# EAGLE design KNXTransceiverBoard_V1.0 (EAGLE 6.1)

## Sheet 1 of 3
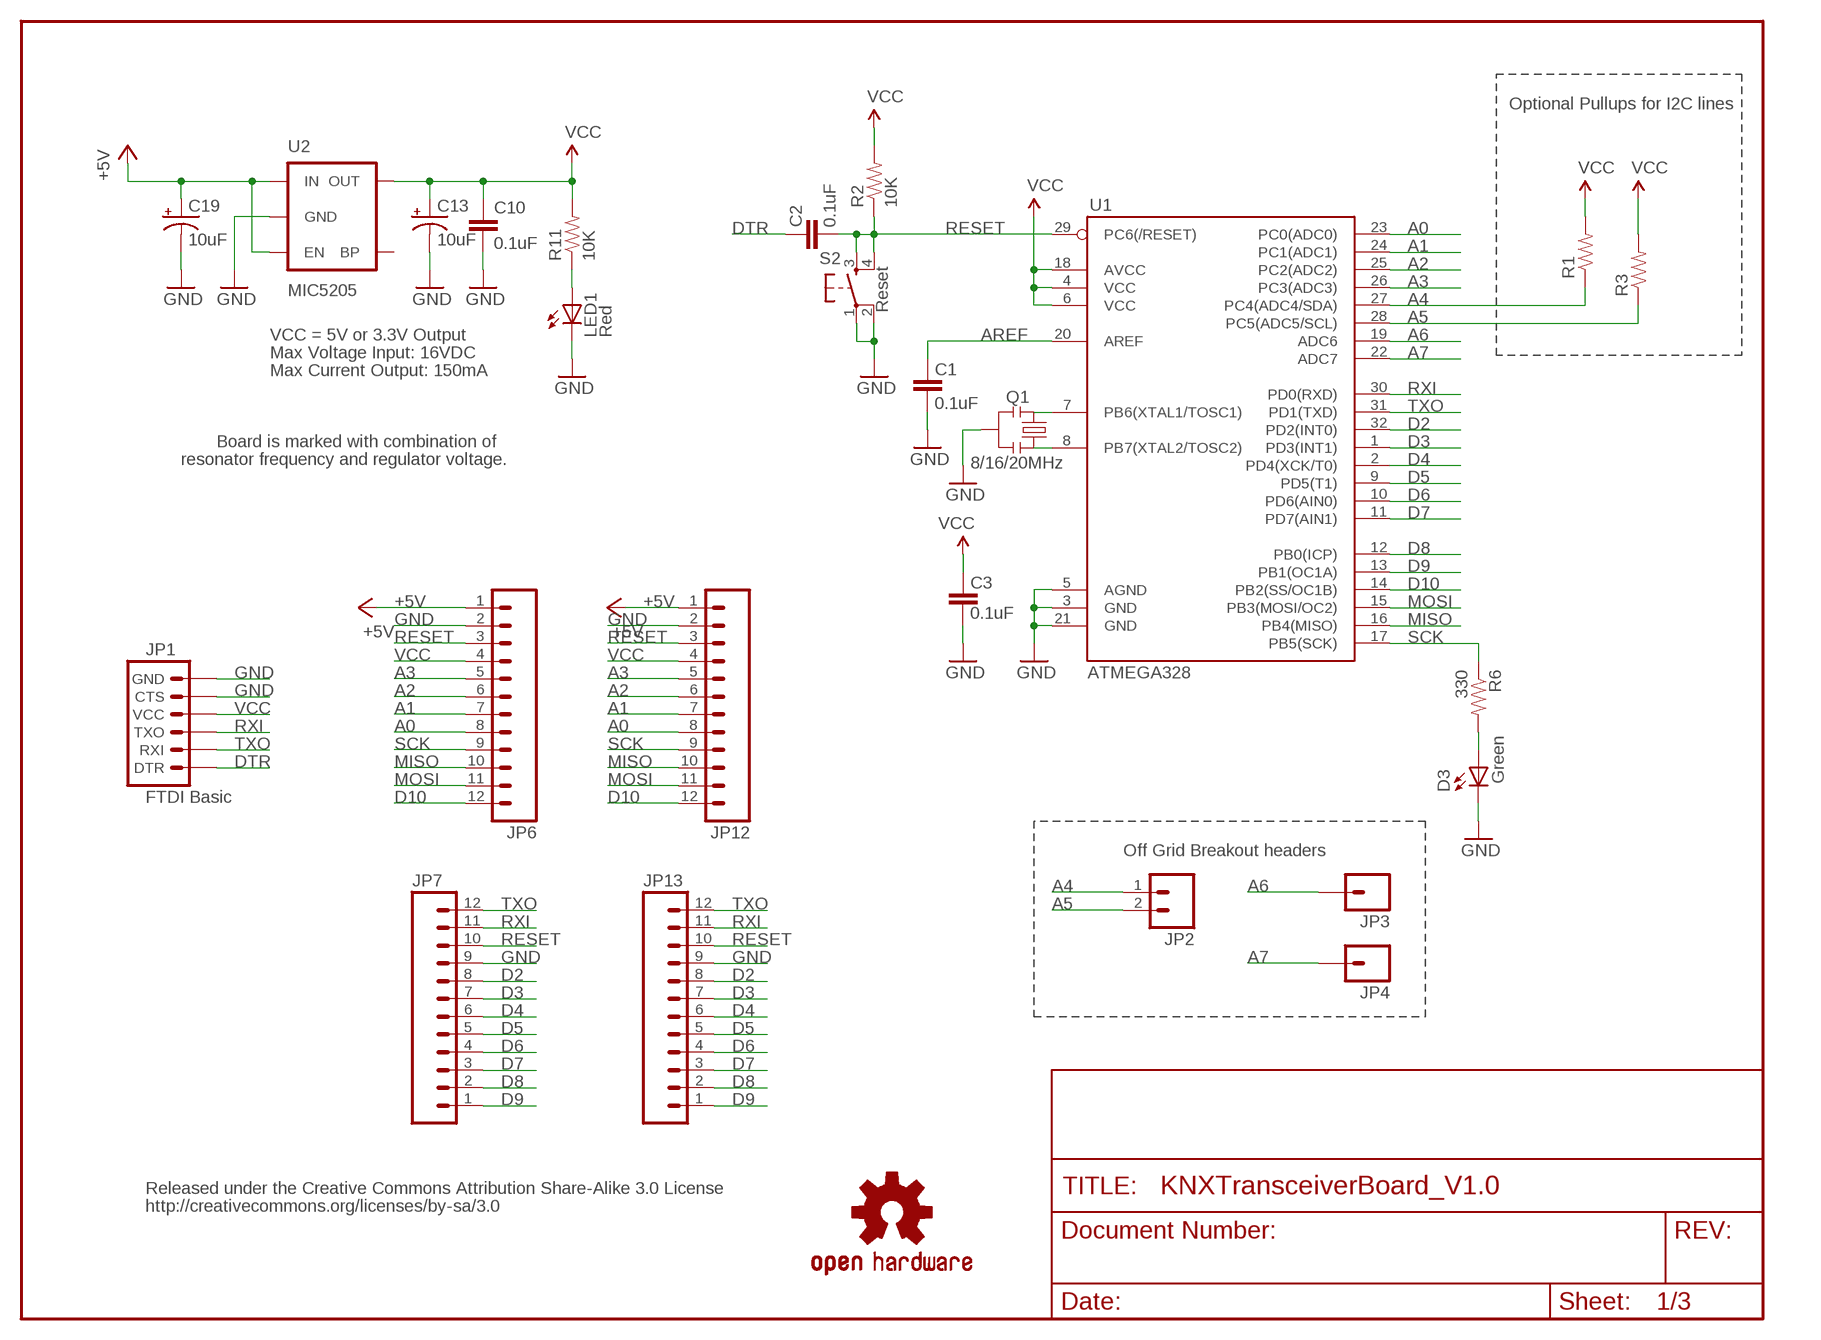
[diagram p0: schematic, sheet 1]

### Parts
C1  0.1uF  CAP0603-CAP  [0603-CAP]
C2  0.1uF  CAP0603-CAP  [0603-CAP]
C3  0.1uF  CAP0603-CAP  [0603-CAP]
C10  0.1uF  CAP0603-CAP  [0603-CAP]
C13  10uF  CAP_POL1206  [EIA3216]
C19  10uF  CAP_POL1206  [EIA3216]
D3  Green  LED0603  [LED-0603]
JP1  FTDI Basic  ARDUINO_SERIAL_PROGRAMPTH  [1X06]
JP2  M02PTH  [1X02]
JP3  M01PTH  [1X01]
JP4  M01PTH  [1X01]
JP6  M12PTH  [1X12]
JP7  M12PTH  [1X12]
JP12  M12PTH  [1X12]
JP13  M12PTH  [1X12]
LED1  Red  LED0603  [LED-0603]
Q1  8/16/20MHz  RESONATORSMD  [RESONATOR-SMD]
R1  RESISTOR0603-RES  [0603-RES]
R2  10K  RESISTOR0603-RES  [0603-RES]
R3  RESISTOR0603-RES  [0603-RES]
R6  330  RESISTOR0603-RES  [0603-RES]
R11  10K  RESISTOR0603-RES  [0603-RES]
S2  Reset  TAC_SWITCHSMD  [TACTILE_SWITCH_SMD]
U1  ATMEGA328  ATMEGA168  [TQFP32-08]
U2  MIC5205  V_REG_LDOSMD  [SOT23-5]
U$3  OSHW-LOGOS  [OSHW-LOGO-S]

### Nets
+5V [vcc]: C19.A(+) JP6.1 JP12.1 U2.1(IN) U2.3(EN) ; also sheet 2
A0: JP6.8 JP12.8 U1.23(PC0(ADC0))
A1: JP6.7 JP12.7 U1.24(PC1(ADC1))
A2: JP6.6 JP12.6 U1.25(PC2(ADC2))
A3: JP6.5 JP12.5 U1.26(PC3(ADC3))
A4: JP2.1 R1.1 U1.27(PC4(ADC4/SDA))
A5: JP2.2 R3.1 U1.28(PC5(ADC5/SCL))
A6: JP3.1 U1.19(ADC6)
A7: JP4.1 U1.22(ADC7)
AREF: C1.2 U1.20(AREF)
D2: JP7.8 JP13.8 U1.32(PD2(INT0)) ; also sheet 3
D3: JP7.7 JP13.7 U1.1(PD3(INT1)) ; also sheet 3
D4: JP7.6 JP13.6 U1.2(PD4(XCK/T0))
D5: JP7.5 JP13.5 U1.9(PD5(T1))
D6: JP7.4 JP13.4 U1.10(PD6(AIN0))
D7: JP7.3 JP13.3 U1.11(PD7(AIN1))
D8: JP7.2 JP13.2 U1.12(PB0(ICP)) ; also sheet 3
D9: JP7.1 JP13.1 U1.13(PB1(OC1A))
D10: JP6.12 JP12.12 U1.14(PB2(SS/OC1B))
DTR: C2.2 JP1.1(DTR)
GND: C1.1 C3.1 C10.2 C13.C(-) C19.C(-) D3.C JP1.5(CTS) JP1.6(GND) JP6.2 JP7.9 JP12.2 JP13.9 LED1.C Q1.2 S2.1 S2.2 U1.3(GND) U1.5(AGND) U1.21(GND) U2.2(GND) ; also sheet 2,3
MISO: JP6.10 JP12.10 U1.16(PB4(MISO))
MOSI: JP6.11 JP12.11 U1.15(PB3(MOSI/OC2))
N$1: Q1.1 U1.8(PB7(XTAL2/TOSC2))
N$2: Q1.3 U1.7(PB6(XTAL1/TOSC1))
N$7: D3.A R6.2
N$38: LED1.A R11.1
RESET: C2.1 JP6.3 JP7.10 JP12.3 JP13.10 R2.1 S2.3 S2.4 U1.29(PC6(/RESET))
RXI: JP1.3(TXO) JP7.11 JP13.11 U1.30(PD0(RXD)) ; also sheet 3
SCK: JP6.9 JP12.9 R6.1 U1.17(PB5(SCK))
TXO: JP1.2(RXI) JP7.12 JP13.12 U1.31(PD1(TXD)) ; also sheet 3
VCC: C3.2 C10.1 C13.A(+) JP1.4(VCC) JP6.4 JP12.4 R1.2 R2.2 R3.2 R11.2 U1.4(VCC) U1.6(VCC) U1.18(AVCC) U2.5(OUT) ; also sheet 2,3
Unconnected: U2.4(BP)

### Notes on the sheet
- Optional Pullups for I2C lines
- VCC = 5V or 3.3V Output
- Max Voltage Input: 16VDC
- Max Current Output: 150mA
- Board is marked with combination of
- resonator frequency and regulator voltage.
- Off Grid Breakout headers
- Released under the Creative Commons Attribution Share-Alike 3.0 License
- http://creativecommons.org/licenses/by-sa/3.0

## Sheet 2 of 3
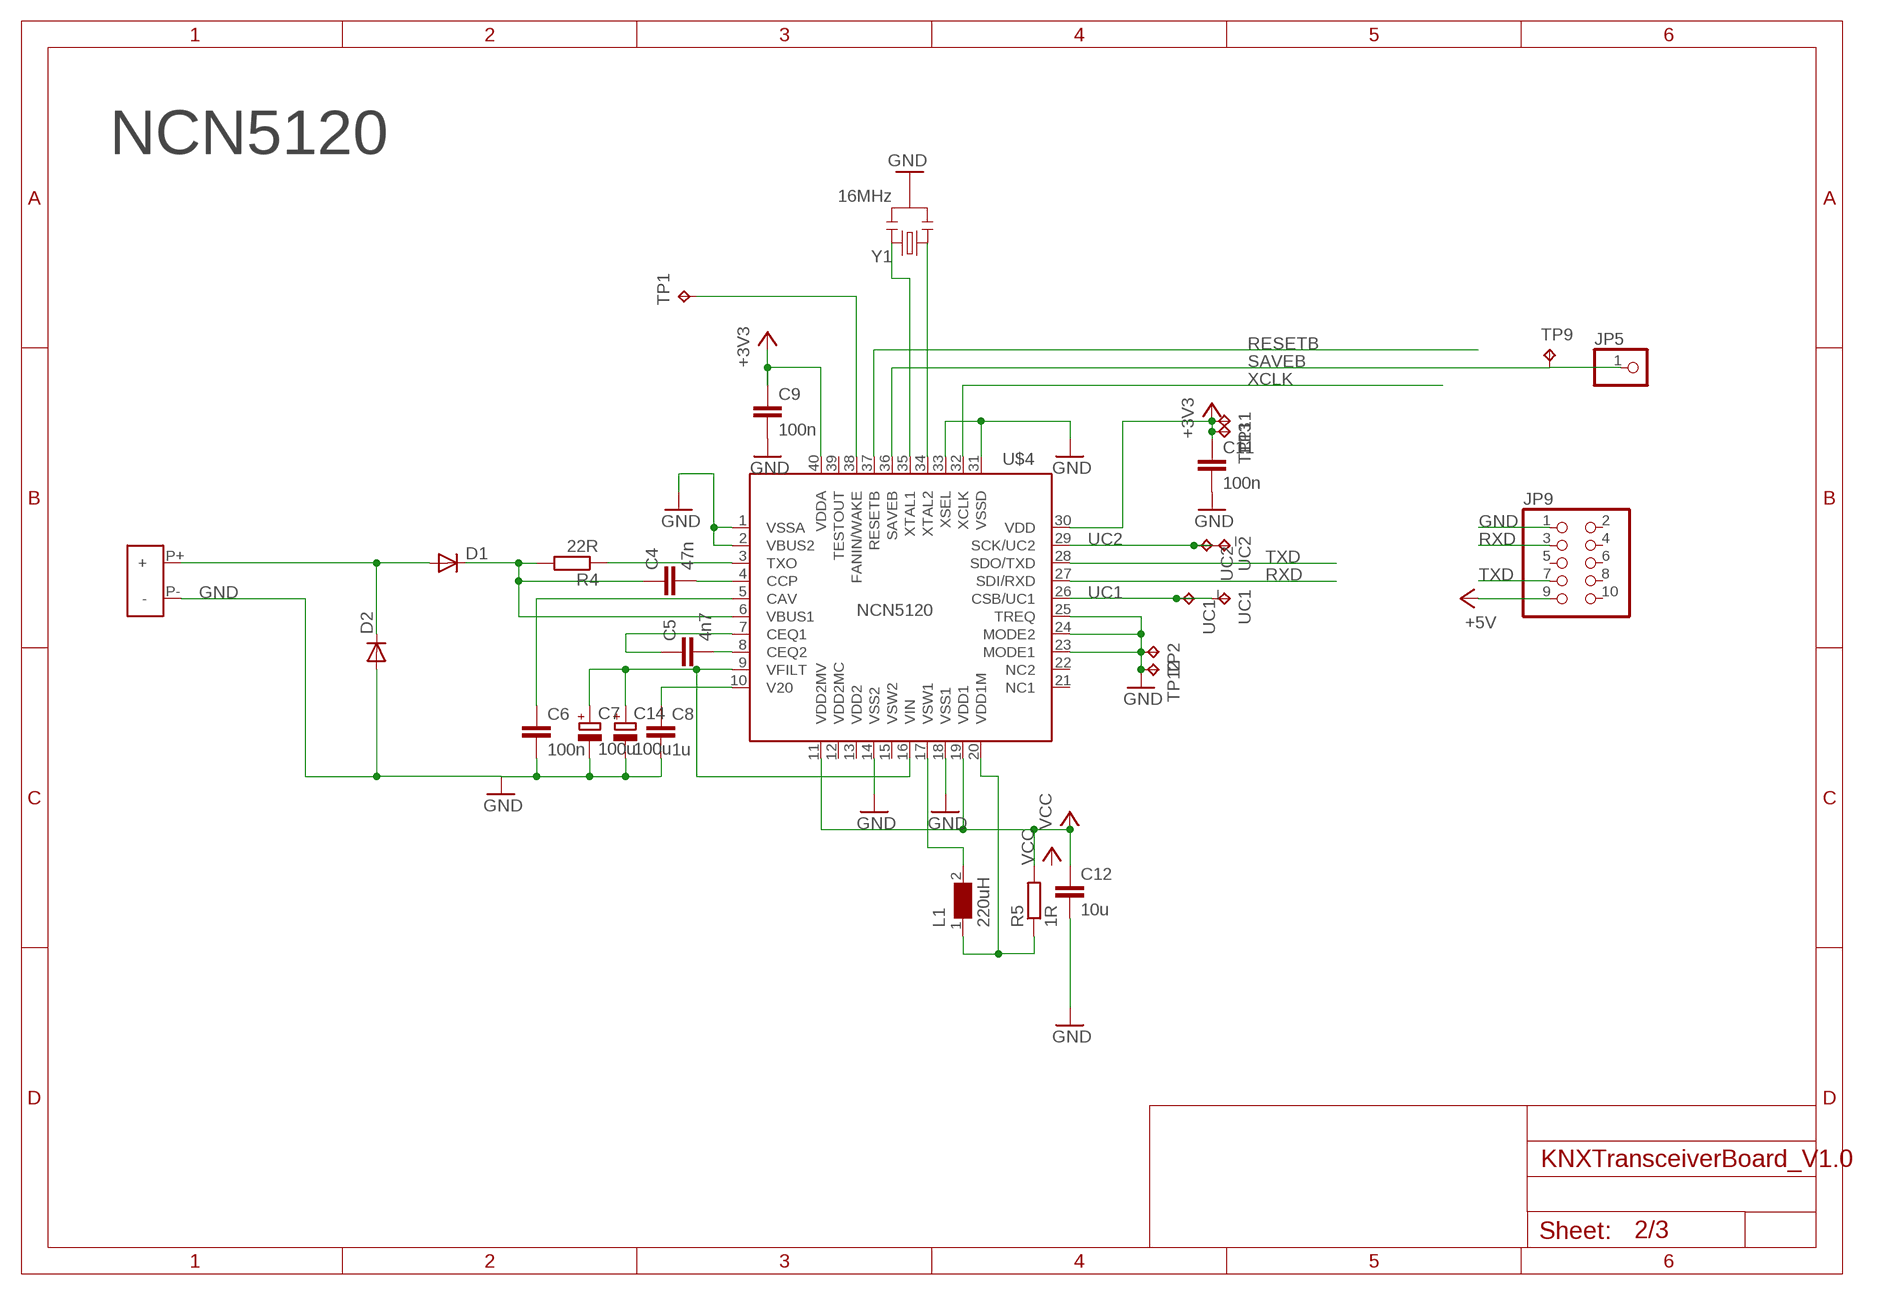
[diagram p1: schematic, sheet 2]

### Parts
C4  47n  C-EUC0603  [C0603]
C5  4n7  C-EUC0603  [C0603]
C6  100n  C-EUC0603  [C0603]
C7  100u  CPOL-EUSMCD  [SMC_D]
C8  1u  C-EUC0603  [C0603]
C9  100n  C-EUC0603  [C0603]
C11  100n  C-EUC0603  [C0603]
C12  10u  C-EUC0805  [C0805]
C14  100u  CPOL-EUSMCD  [SMC_D]
D1  DIODESMA-ALT  [SMA-DIODE_ALT]
D2  DIODESMA-ALT  [SMA-DIODE_ALT]
JP5  PINHD-1X1  [1X01]
JP9  PINHD-2X5  [2X05]
L1  220uH  WE-PD2_7850  [WE-PD2_7850]
R4  22R  R-EU_R2512  [R2512]
R5  1R  R-EU_R0603  [R0603]
TP1  TPTP10SQ  [TP10SQ]
TP2  TPTP09SQ  [TP09SQ]
TP9  TPTP10SQ  [TP10SQ]
TP11  TPTP09SQ  [TP09SQ]
TP12  TPTP09SQ  [TP09SQ]
TP13  TPTP09SQ  [TP09SQ]
U$2  KNX_KLEMME  [KNX_KLEMME]
U$4  NCN5120_KNX_TRANSCEIVER  [QFN40]
UC1  TPTP09SQ  [TP09SQ]
UC1_  TPTP09SQ  [TP09SQ]
UC2  TPTP09SQ  [TP09SQ]
UC2_  TPTP09SQ  [TP09SQ]
Y1  16MHz  RESONATORSMD  [RESONATOR-SMD]

### Nets
+5V [vcc]: JP9.9 ; also sheet 1
GND: C6.2 C7.- C8.2 C9.2 C11.2 C12.2 C14.- D2.A JP9.1 TP2.TP TP12.TP U$2.P-(-) U$4.1(VSSA) U$4.2(VBUS2) U$4.14(VSS2) U$4.18(VSS1) U$4.23(MODE1) U$4.24(MODE2) U$4.25(TREQ) U$4.31(VSSD) U$4.33(XSEL) Y1.2 ; also sheet 1,3
N$3: R4.1 U$4.3(TXO)
N$4: C4.1 D1.C R4.2 U$4.6(VBUS1)
N$5: C5.1 U$4.7(CEQ1)
N$6: C7.+ C14.+ U$4.9(VFILT) U$4.16(VIN)
N$8: C8.1 U$4.10(V20)
N$9: C6.1 U$4.5(CAV)
N$10: C4.2 U$4.4(CCP)
N$11: C5.2 U$4.8(CEQ2)
N$12: D1.A D2.C U$2.P+(+)
N$14: TP1.TP U$4.38(FANIN/WAKE)
N$17: U$4.35(XTAL1) Y1.3
N$18: U$4.34(XTAL2) Y1.1
N$22: L1.2 U$4.17(VSW1)
N$24: L1.1 R5.1 U$4.20(VDD1M)
RESETB: U$4.37(RESETB)
RXD: JP9.3 U$4.27(SDI/RXD) ; also sheet 3
SAVEB: JP5.1 TP9.TP U$4.36(SAVEB)
TXD: JP9.7 U$4.28(SDO/TXD) ; also sheet 3
UC1: U$4.26(CSB/UC1) UC1.TP UC1_.TP
UC2: U$4.29(SCK/UC2) UC2.TP UC2_.TP
VCC: C9.1 C11.1 C12.1 R5.2 TP11.TP TP13.TP U$4.11(VDD2MV) U$4.19(VDD1) U$4.30(VDD) U$4.40(VDDA) ; supply symbol labelled +3V3 ; also sheet 1,3
XCLK: U$4.32(XCLK)
Unconnected: JP9.2 JP9.4 JP9.5 JP9.6 JP9.8 JP9.10 U$4.12(VDD2MC) U$4.13(VDD2) U$4.15(VSW2) U$4.21(NC1) U$4.22(NC2) U$4.39(TESTOUT)

### Notes on the sheet
- NCN5120

## Sheet 3 of 3
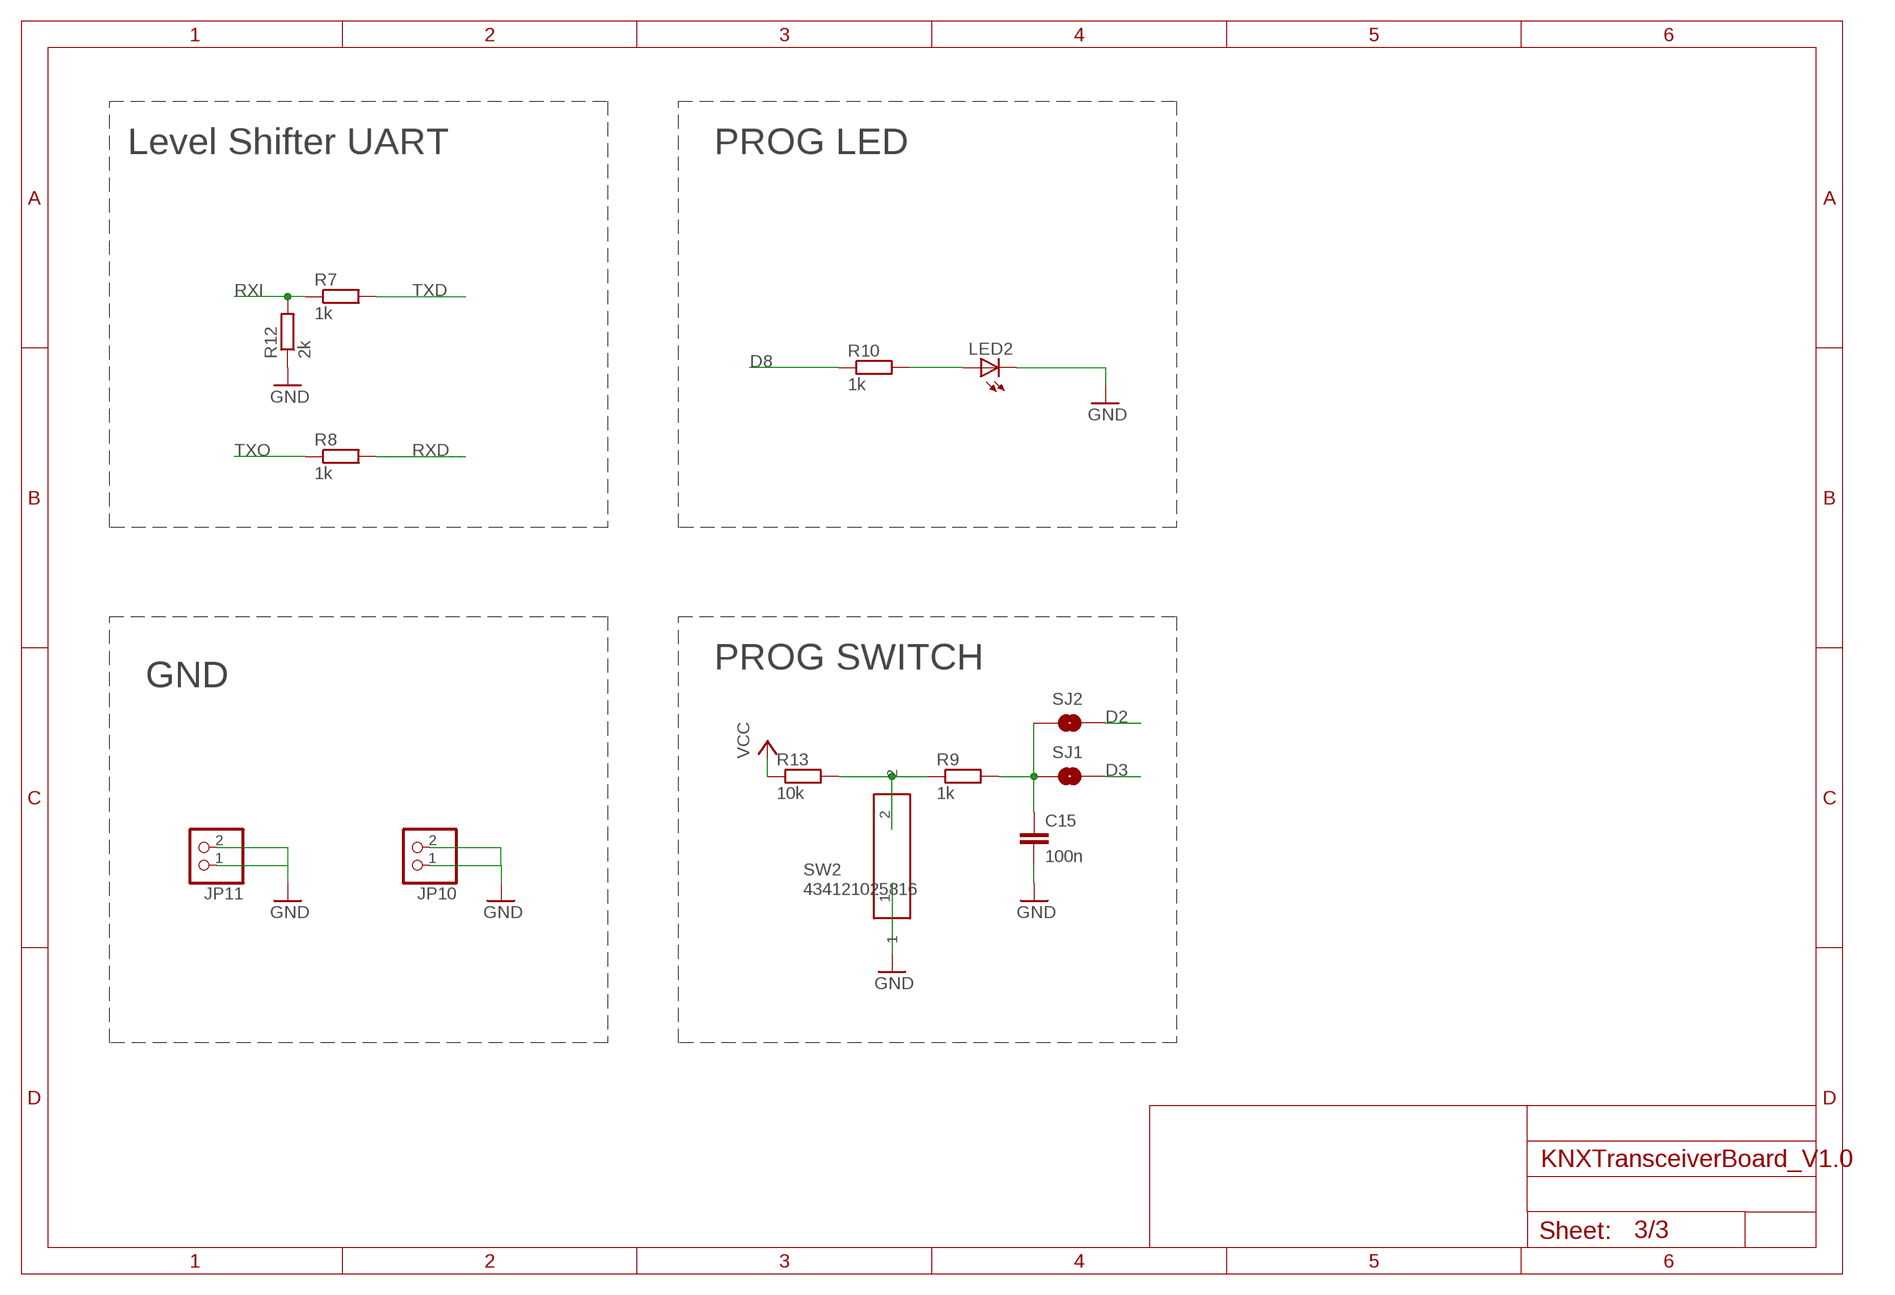
[diagram p2: schematic, sheet 3]

### Parts
C15  100n  C-EUC0603  [C0603]
JP10  PINHD-1X2  [1X02]
JP11  PINHD-1X2  [1X02]
LED2  LEDCHIP-LED0805  [CHIP-LED0805]
R7  1k  R-EU_R0603  [R0603]
R8  1k  R-EU_R0603  [R0603]
R9  1k  R-EU_R0603  [R0603]
R10  1k  R-EU_R0603  [R0603]
R12  2k  R-EU_R0805  [R0805]
R13  10k  R-EU_R0603  [R0603]
SJ1  Closed for 5V Board  SOLDERJUMPERNC  [SJ_2S]
SJ2  Closed for 5V Board  SOLDERJUMPERNC  [SJ_2S]
SW2  434121025816  [434121025816]

### Nets
D2: SJ2.2 ; also sheet 1
D3: SJ1.2 ; also sheet 1
D8: R10.1 ; also sheet 1
GND: C15.2 JP10.1 JP10.2 JP11.1 JP11.2 LED2.C R12.1 SW2.1 ; also sheet 1,2
N$13: R9.1 R13.2 SW2.2
N$15: LED2.A R10.2
PROG_SW: C15.1 R9.2 SJ1.1 SJ2.1
RXD: R8.2 ; also sheet 2
RXI: R7.1 R12.2 ; also sheet 1
TXD: R7.2 ; also sheet 2
TXO: R8.1 ; also sheet 1
VCC: R13.1 ; also sheet 1,2

### Notes on the sheet
- Level Shifter UART | PROG LED
- PROG SWITCH
- GND

## Library data of the parts
C1-C3 C10 = SparkFun:CAP: Capacitor Standard 0603 ceramic capacitor, and 0.1" leaded capacitor.
C4-C6 C8 C9 C11 C12 C15 = rcl:C-EU: CAPACITOR, European symbol
C7 C14 = rcl:CPOL-EU: POLARIZED CAPACITOR, European symbol
C13 C19 = SparkFun:CAP_POL: Capacitor Polarized These are standard SMD and PTH capacitors. Normally 10uF, 47uF, and 100uF in electrolytic and tantalum varieties. Always verify the external diameter of the through hole cap, it varies with capacity, voltage, and manufacturer. The EIA devices should be standard.
D1 D2 = SparkFun:DIODE: Diode These are standard reverse protection diodes and small signal diodes. SMA package can handle up to about 1A. SOD-323 can handle about 200mA. What the SOD-323 package when ordering, there are some mfgs out there that are 5-pin packages.
D3 LED1 = SparkFun:LED: LEDs Standard schematic elements and footprints for 5mm, 3mm, 1206, and 0603 sized LEDs. 5mm - Spark Fun Electronics SKU : COM-00529 (and others)
JP1 = SparkFun:ARDUINO_SERIAL_PROGRAM
JP2 = SparkFun:M02: Header 2 Standard 2-pin 0.1" header. Use with straight break away headers (SKU : PRT-00116), right angle break away headers (PRT-00553), swiss pins (PRT-00743), machine pins (PRT-00117), and female headers (PRT-00115). Molex polarized connector foot print use with SKU : PRT-08233 with associated crimp pins and housings.
JP3 JP4 = SparkFun:M01: Header 1 Standard 1-pin 0.1" header. Use with straight break away headers (SKU : PRT-00116), right angle break away headers (PRT-00553), swiss pins (PRT-00743), machine pins (PRT-00117), and female headers (PRT-00115).
JP5 = pinhead:PINHD-1X1: PIN HEADER
JP6 JP7 JP12 JP13 = SparkFun:M12: Header 12 Standard 12-pin 0.1" header. Use with straight break away headers (SKU : PRT-00116), right angle break away headers (PRT-00553), swiss pins (PRT-00743), machine pins (PRT-00117), and female headers (PRT-00115).
JP9 = pinhead:PINHD-2X5: PIN HEADER
JP10 JP11 = pinhead:PINHD-1X2: PIN HEADER
L1 = Wuerth_PowerMagnetics:WE-PD2: SMD-Power Inductors WE-PD2 - Industry standard size - Current capability up to 14 A -- Switching regulators with low operating voltages (computer, laptop, mobile phones, pagers) -- Integrated DC/DC-converter -- Is recommended for the application with switching regulators from National Semiconductor, Linear Technology, Texas Instruments and Fairchild Semiconductor -- Perfectly suitable for switching regulators with extremely high efficiency
LED2 = adafruit:LED: LED OSRAM: - CHIPLED LG R971, LG N971, LY N971, LG Q971, LY Q971, LO R971, LY R971 LH N974, LH R974 LS Q976, LO Q976, LY Q976 LO Q996 - Hyper CHIPLED LW Q18S LB Q993, LB Q99A, LB R99A - SideLED LS A670, LO A670, LY A670, LG A670, LP A670 LB A673, LV A673, LT A673, LW A673 LH A674 LY A675 LS A676, LA A676, LO A676, LY A676, LW A676 LS A679, LY A679, LG A679 - Hyper Micro SIDELED® LS Y876, LA Y876, LO Y876, LY Y876 LT Y87S - SmartLED LW L88C, LW L88S LB L89C, LB L89S, LG L890 LS L89K, LO L89K, LY L89K LS L896, LA L896, LO L896, LY L896 - TOPLED LS T670, LO T670, LY T670, LG T670, LP T670 LSG T670, LSP T670, LSY T670, LOP T670, LYG T670 LG T671, LOG T671, LSG T671 LB T673, LV T673, LT T673, LW T673 LH T674 LS T676, LA T676, LO T676, LY T676, LB T676, LH T676, LSB T676, LW T676 LB T67C, LV T67C, LT T67C, LS T67K, LO T67K, LY T67K, LW E67C LS E67B, LA E67B, LO E67B, LY E67B, LB E67C, LV E67C, LT E67C LW T67C LS T679, LY T679, LG T679 LS T770, LO T770, LY T770, LG T770, LP T770 LB T773, LV T773, LT T773, LW T773 LH T774 LS E675, LA E675, LY E675, LS T675 LS T776, LA T776, LO T776, LY T776, LB T776 LHGB T686 LT T68C, LB T68C - Hyper Mini TOPLED® LB M676 - Mini TOPLED Santana® LG M470 LS M47K, LO M47K, LY M47K Source: http://www.osram.convergy.de/
Q1 Y1 = SparkFun:RESONATOR: Resonator Small SMD resonator. This is the itty bitty 10/20MHz resonators with built in caps. CSTCE10M0G55 and CSTCE20M0V53. Footprint has been reviewed closely but hasn't been tested yet.
R1-R3 R6 R11 = SparkFun:RESISTOR: Resistor Basic schematic elements and footprints for 0603, 1206, and PTH resistors.
R4 R5 R7-R10 R12 R13 = rcl:R-EU_: RESISTOR, European symbol
S2 = SparkFun:TAC_SWITCH: Momentary Switch Button commonly used for reset or general input. Spark Fun Electronics SKU : COM-00097
SJ1 SJ2 = SparkFun:SOLDERJUMPER: Solder Jumper Standard SMD solder jumper. Used to automate production. Two varients : Normally Open and Normally Closed are the same, but have different paste layers. NC will have a large amount of paste and should jumper during reflow.
SW2 = Wuerth_Kurzhubtaster:434121025816: WS-TRS-6x3.8 mm SMD Tact Switch, 2 pins
TP1 TP2 TP9 TP11-TP13 UC1 UC1_ UC2 UC2_ = testpad:TP: Test pad
U1 = SparkFun:ATMEGA168
U2 = SparkFun:V_REG_LDO: Voltage Regulator LDO Standard 150mA LDO voltage regulator in SOT-23 layout. Micrel part MIC5205. BP (by-pass) pin is used to lower output noise with 470pF cap.
U$2 = Matthias_1:KNX_KLEMME
U$3 = SparkFun:OSHW-LOGO: Open Source Hardware Logo This logo indicates the piece of hardware it is found on incorporates a OSHW license and/or adheres to the definition of open source hardware found here: http://freedomdefined.org/OSHW
U$4 = Matthias_1:NCN5120_KNX_TRANSCEIVER

## Net classes
0 default: width 0.203 mm
1 vcc: width 0.254 mm

## Board
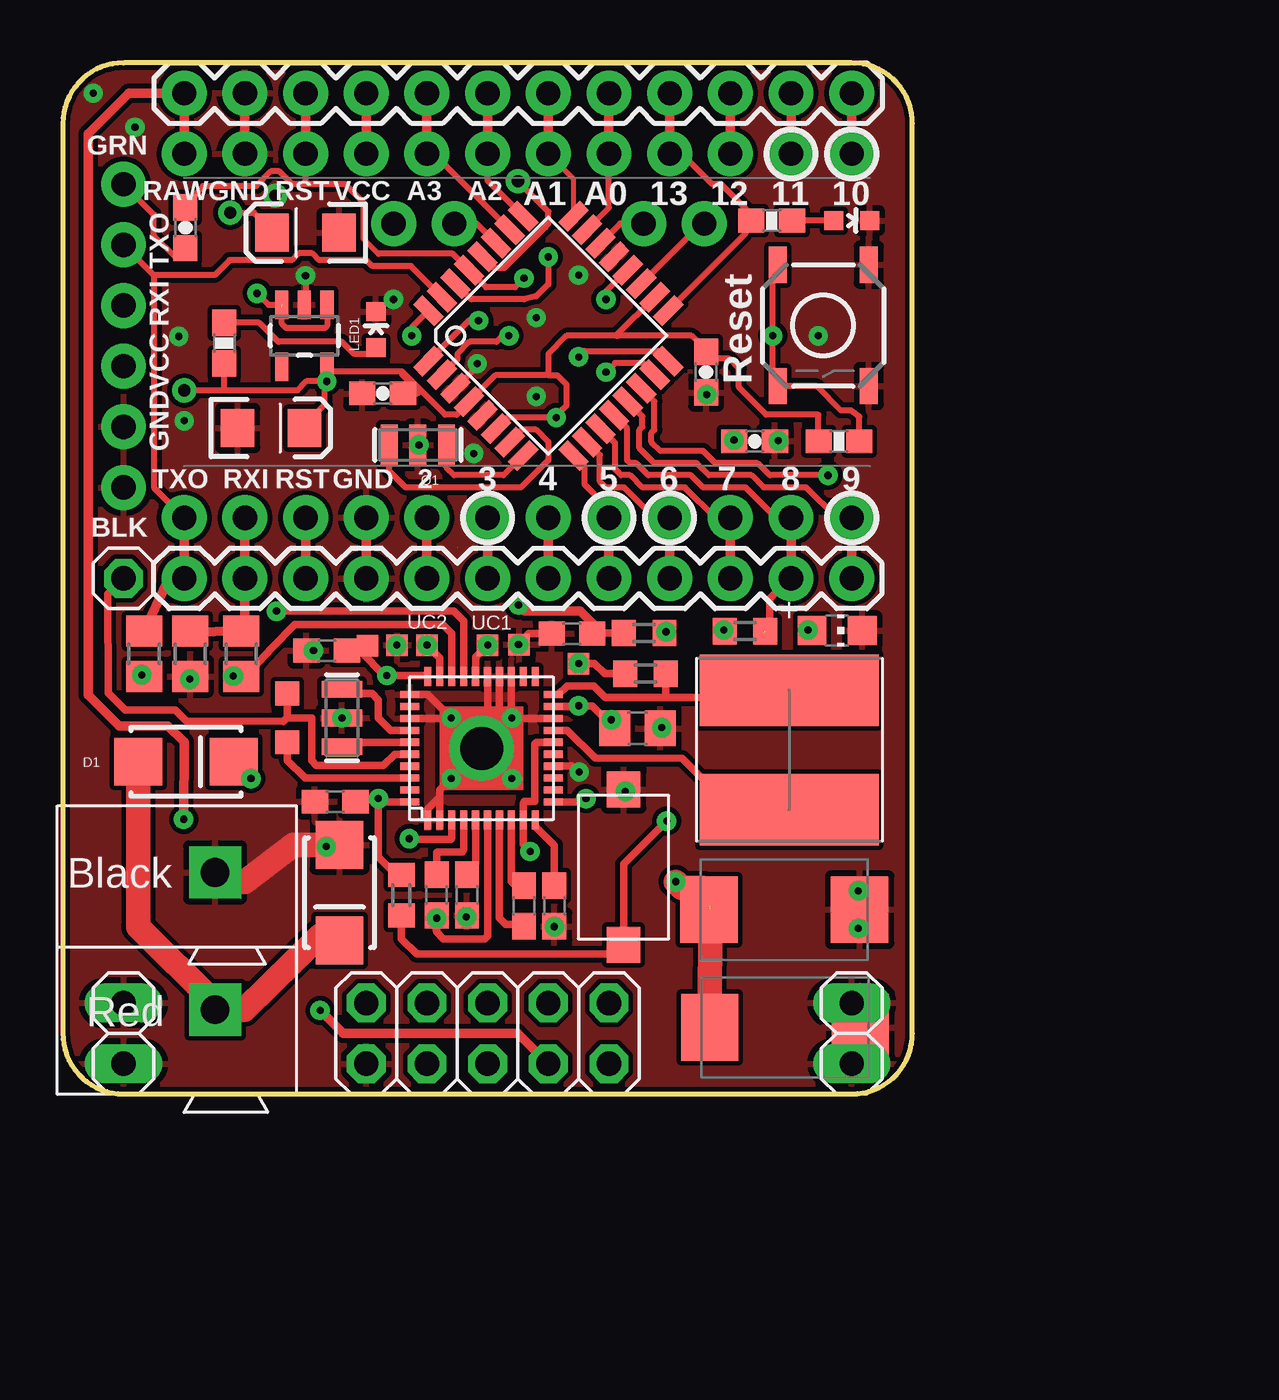
[diagram p3: board, top side]
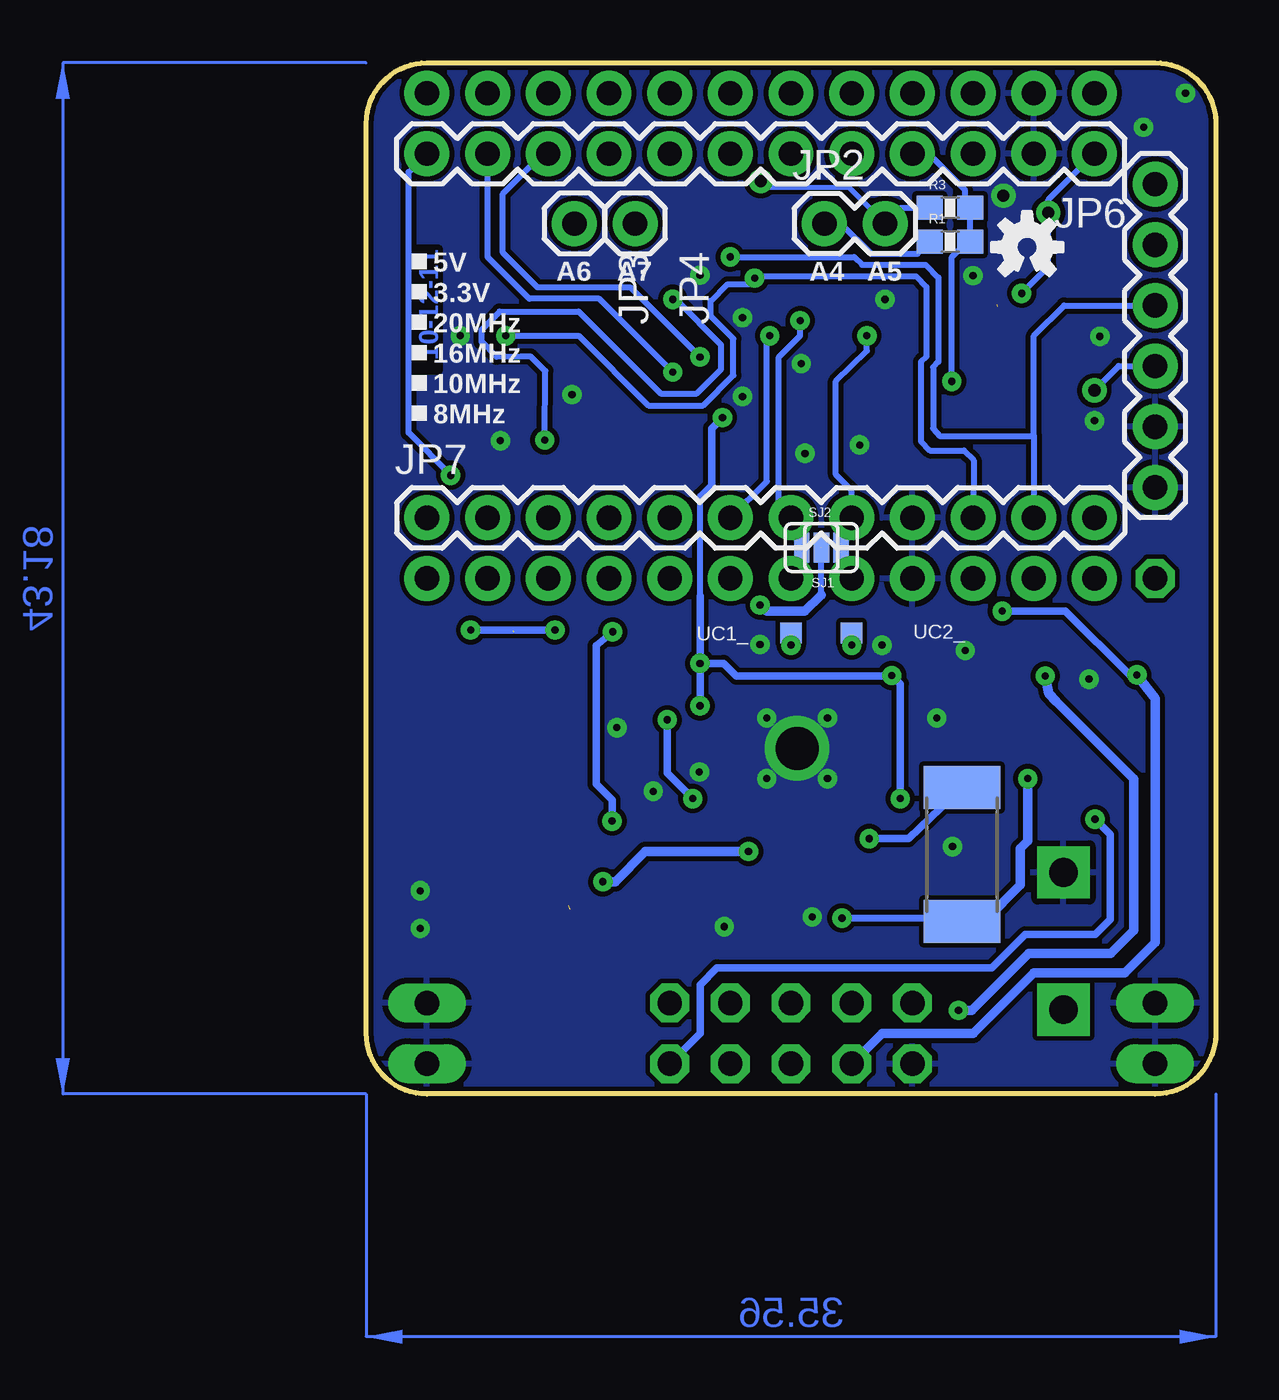
[diagram p4: board, bottom side, seen from below]

Size 35.56 x 43.18 mm. Coordinates in mm from the lower left corner, seen from the top.
Outline: 0,2.54 arc90 2.54,0 33.02,0 arc90 35.56,2.54 35.56,40.64 arc90 33.02,43.18 2.54,43.18 arc90 0,40.64 0,2.54
Copper layers (1*16): Top 0.035mm / dielectric 1.5mm / Bottom 0.035mm
Design rules: minimum track width 8mil, minimum drill 20mil, track to track 8mil, track to pad 8mil, pad to pad 8mil, via to via 8mil, smd to smd 8mil, copper to edge 8mil, drill to drill 8mil, minimum pad ring 12mil, minimum via ring 10mil, stop-mask expansion 4mil, vias tented up to drill 20mil, thermal gap 10mil

### Footprints (pad centres in the part's own frame; a part is rotated, then mirrored left to right if it is on the bottom)
0603-CAP = smd 1.1 x 1: 1 -0.85,0; 2 0.85,0
C0603 = smd 1.1 x 1: 1 -0.85,0; 2 0.85,0
SMC_D = smd 2.4 x 2.8: + -3.15,0; - 3.15,0
C0805 = smd 1.3 x 1.5: 1 -0.95,0; 2 0.95,0
EIA3216 = smd 1.4 x 1.6: A 1.4,0; C -1.4,0
SMA-DIODE_ALT = smd 2 x 2: A -2,0; C 2,0
LED-0603 = smd 0.8 x 0.8: A 0,-0.75; C 0,0.75
1X06 = drill 1.016 pad 1.88: 1 0,0; 2 2.54,0; 3 5.08,0; 4 7.62,0; 5 10.16,0; 6 12.7,0
1X02 = drill 1.016 pad 1.88: 1 0,0; 2 2.54,0
1X01 = drill 1.016 pad 1.88: 1 0,0
1X01' = drill 1.016 octagon: 1 0,0
1X12 = drill 1.016 pad 1.88: 1 0,0; 2 2.54,0; 3 5.08,0; 4 7.62,0; 5 10.16,0; 6 12.7,0; 7 15.24,0; 8 17.78,0; 9 20.32,0; 10 22.86,0; 11 25.4,0; 12 27.94,0
2X05 = drill 1.016 octagon: 1 -5.08,-1.27; 2 -5.08,1.27; 3 -2.54,-1.27; 4 -2.54,1.27; 5 0,-1.27; 6 0,1.27; 7 2.54,-1.27; 8 2.54,1.27; 9 5.08,-1.27; 10 5.08,1.27
1X02' = drill 1.016 long: 1 -1.27,0; 2 1.27,0
WE-PD2_7850 = smd 3 x 7.5: 1 -2.5,0; 2 2.5,0
CHIP-LED0805 = smd 1.2 x 1.2: A 0,-1.05; C 0,1.05
RESONATOR-SMD = smd 0.7 x 1.7: 1 -1.2,0; 2 0,0; 3 1.2,0
0603-RES = smd 1.1 x 1: 1 -0.85,0; 2 0.85,0
R2512 = smd 1.8 x 3.2: 1 -2.8,0; 2 2.8,0
R0603 = smd 1 x 1.1: 1 -0.85,0; 2 0.85,0
R0805 = smd 1.3 x 1.5: 1 -0.95,0; 2 0.95,0
TACTILE_SWITCH_SMD = smd 1.524 x 0.762: 1 -2.54,1.905; 2 2.54,1.905; 3 -2.54,-1.905; 4 2.54,-1.905
SJ_2S = smd 0.635 x 1.27: 1 -0.412,0; 2 0.412,0
434121025816 = smd 1.5 x 1.4: 1 -3.25,0; 2 3.25,0
TP10SQ = smd 1 x 1: TP 0,0
TP09SQ = smd 0.9 x 0.9: TP 0,0
TQFP32-08 = smd 1.27 x 0.559: 1 -4.293,2.8; 2 -4.293,2; 3 -4.293,1.2; 4 -4.293,0.4; 5 -4.293,-0.4; 6 -4.293,-1.2; 7 -4.293,-2; 8 -4.293,-2.8; 17 4.293,-2.8; 18 4.293,-2; 19 4.293,-1.2; 20 4.293,-0.4; 21 4.293,0.4; 22 4.293,1.2; 23 4.293,2; 24 4.293,2.8 | smd 0.559 x 1.27: 9 -2.8,-4.293; 10 -2,-4.293; 11 -1.2,-4.293; 12 -0.4,-4.293; 13 0.4,-4.293; 14 1.2,-4.293; 15 2,-4.293; 16 2.8,-4.293; 25 2.8,4.293; 26 2,4.293; 27 1.2,4.293; 28 0.4,4.293; 29 -0.4,4.293; 30 -1.2,4.293; 31 -2,4.293; 32 -2.8,4.293
SOT23-5 = smd 0.55 x 1.2: 1 -0.95,-1.3; 2 0,-1.3; 3 0.95,-1.3; 4 0.95,1.3; 5 -0.95,1.3
KNX_KLEMME = drill 1.2 pad 2.184 square: P+ 0,-3.2; P- 0,2.55
QFN40 = smd 0.3 x 0.8: 1 -2.25,-3; 2 -1.75,-3; 3 -1.25,-3; 4 -0.75,-3; 5 -0.25,-3; 6 0.25,-3; 7 0.75,-3; 8 1.25,-3; 9 1.75,-3; 10 2.25,-3; 21 2.25,3; 22 1.75,3; 23 1.25,3; 24 0.75,3; 25 0.25,3; 26 -0.25,3; 27 -0.75,3; 28 -1.25,3; 29 -1.75,3; 30 -2.25,3 | smd 0.8 x 0.3: 11 3,-2.25; 12 3,-1.75; 13 3,-1.25; 14 3,-0.75; 15 3,-0.25; 16 3,0.25; 17 3,0.75; 18 3,1.25; 19 3,1.75; 20 3,2.25; 31 -3,2.25; 32 -3,1.75; 33 -3,1.25; 34 -3,0.75; 35 -3,0.25; 36 -3,-0.25; 37 -3,-0.75; 38 -3,-1.25; 39 -3,-1.75; 40 -3,-2.25

### Placement (x,y rotation side)
C1  28.96,27.33 180 top
C2  5.13,36.27 270 top
C3  26.92,30.23 90 top
C4  15.65,8.33 90 top
C5  19.3,7.87 90 top
C6  16.92,8.33 270 top
C7  30.23,2.79 0 top
C8  20.57,7.87 270 top
C9  11.4,12.24 180 top
C10  13.39,29.34 180 top
C11  11.05,18.57 180 top
C12  24.05,15.32 0 top
C13  8.71,27.89 0 top
C14  30.2,7.72 0 top
C15  21.31,19.28 180 top
C19  10.16,36.07 180 top
D1  5.16,13.92 0 top
D2  11.58,8.43 270 top
D3  33.02,36.58 270 top
JP1  2.54,38.1 270 bottom
JP2  16.38,36.45 0 bottom
JP3  26.85,36.45 270 bottom
JP4  24.31,36.45 270 bottom
JP5  [1X01']  2.54,21.59 0 top
JP6  5.08,39.37 180 bottom
JP7  33.02,24.13 0 bottom
JP9  17.78,2.54 0 top
JP10  [1X02']  2.54,2.54 90 top
JP11  [1X02']  33.02,2.54 90 top
JP12  5.08,41.91 0 top
JP13  33.02,21.59 180 top
L1  30.4,14.4 270 top
LED1  13.11,32 0 top
LED2  32.41,19.41 270 top
Q1  14.86,27.18 180 top
R1  11.13,35.69 0 bottom
R2  32.49,27.33 180 top
R3  11.13,37.11 0 bottom
R4  10.62,10.03 270 bottom
R5  24.38,17.6 180 top
R6  29.67,36.58 0 top
R7  1k  [R0805]  7.47,18.44 270 top
R8  1k  [R0805]  3.4,18.44 270 top
R9  24.33,19.3 180 top
R10  28.55,19.38 180 top
R11  6.76,31.45 270 top
R12  5.33,18.44 90 top
R13  14.17,8.33 270 top
S2  31.83,32.18 270 top
SJ1  16.92,22.89 180 bottom
SJ2  16.1,22.89 0 bottom
SW2  23.47,9.5 270 top
TP1  9.4,14.73 0 top
TP2  14,18.8 0 top
TP9  9.4,16.76 0 top
TP11  12.75,18.77 0 top
TP12  19.1,18.82 0 top
TP13  21.59,18.01 0 top
U1  20.32,31.75 45 top
U2  10.11,31.75 180 top
U$2  6.38,6.73 0 top
U$3  7.9,35.46 0 bottom
U$4  17.53,14.48 0 top
UC1  17.78,18.8 0 top
UC1_  17.78,19.3 0 bottom
UC2  15.24,18.8 0 top
UC2_  15.24,19.3 0 bottom
Y1  11.68,15.75 270 top

### Tracks (layer width: path | path; a pad name or v marks a point on that pad's centre or on a via)
+5V  (via drill 0.3, 0.51)  (1 unrouted)
  Top 0.254: v8.13,33.53 8.61,33.05 U2.3 | v7.01,36.91 8,36.91 8.79,36.12 8.76,36.09 C19.A | U2.1 11.06,32.17 10.97,32.08 9.35,32.08 9.17,32.26 9.17,32.94 9.14,32.97
  Top 0.406: v5.05,11.51 5.08,14.73 4.39,15.42 2.36,15.42 1.07,16.71 1.07,40.21 2.77,41.91 JP12.1 JP6.1
  Bottom 0.254: v8.13,33.53 7.01,34.65 v7.01,36.91 7.01,37.44 JP6.1
  Bottom 0.305: JP9.9 21.59,2.54 21.59,4.57 20.88,5.28 9.37,5.28 7.98,6.68 5.05,6.68 4.42,7.32 4.42,10.87 v5.05,11.51
A0
  Top 0.254: U1.23 22.86,37.12 JP6.8
  Top 0.406: JP12.8 JP6.8
A1
  Top 0.203: U1.24 21.38,38.31 JP6.7
  Top 0.406: JP12.7 JP6.7
A2
  Top 0.254: U1.25 17.78,38.25 JP6.6
  Top 0.406: JP12.6 JP6.6
A3
  Top 0.254: U1.26 15.53,39.37 JP6.5
  Top 0.406: JP12.5 JP6.5
A4
  Top 0.254: U1.27 17.32,36.45 JP2.1
  Bottom 0.254: JP2.1 15.7,36.45 14.43,35.18 12.49,35.18 11.78,35.89 R1.1
A5  (via drill 0.51)
  Top 0.254: v19.05,38.23 20.32,36.96 20.32,36.45 20.19,36.32 20.19,36.3 18.49,34.59 18.04,34.59 U1.28
  Bottom 0.203: v19.05,38.23 18.8,37.97 15.37,37.97 JP2.2
  Bottom 0.254: R3.1 13.18,37.11 JP2.2
A6
  Top 0.254: U1.19 26.72,36.45 JP3.1
A7
  Top 0.254: U1.22 23.32,36.45 JP4.1
AREF  (via drill 0.3)
  Top 0.254: v28.09,27.38 27.96,27.3 C1.2 | U1.20 22.73,33.6 v22.73,33.27
  Bottom 0.254: v22.73,33.27 22.61,33.27 20.7,31.37 20.7,30.35 21.72,29.34 23.24,29.34 26.67,32.77 29.97,32.77 30.73,32 30.73,31.5 30.1,30.86 29.08,30.89 28.68,30.89 28.07,30.28 v28.09,27.38
D2  (via drill 0.3)
  Top 0.254: U1.32 14.61,32.11 v14.61,31.75
  Top 0.406: JP13.8 JP7.8
  Bottom 0.254: v14.61,31.75 14.61,31.11 15.9,29.84 15.9,25.93 15.24,25.27 JP7.8 15.69,23.68 SJ2.2
D3  (via drill 0.3)
  Top 0.254: U1.1 17,32.38 v17.4,32.38
  Top 0.406: JP13.7 JP7.7
  Bottom 0.254: v17.4,32.38 17.4,31.75 18.29,30.86 18.29,24.64 JP7.7 17.33,23.68 SJ1.2
D4  (via drill 0.3)
  Top 0.254: v18.67,31.75 18.67,32 18.16,31.5 17.02,31.5 16.51,30.99 16.51,30.77 U1.2
  Top 0.406: JP13.6 JP7.6
  Bottom 0.254: JP7.6 18.8,25.65 18.8,31.62 v18.67,31.75
D5
  Top 0.254: U1.9 21.84,26.27 21.84,25.53 22.86,24.51 JP7.5
  Top 0.406: JP13.5 JP7.5
D6
  Top 0.254: 25.11,24.13 JP7.4 24.77,24.13 23.5,25.4 22.73,25.4 22.48,25.65 22.48,26.76 U1.10
  Top 0.406: JP13.4 JP7.4
D7
  Top 0.254: JP7.3 27.3,24.13 26.04,25.4 24.26,25.4 23.75,25.91 23.37,25.91 23.11,26.16 23.11,27.26 U1.11
  Top 0.406: JP13.3 JP7.3
D8  (1 unrouted)
  Top 0.254: JP7.2 29.84,24.13 28.57,25.4 26.8,25.4 26.29,25.91 24.51,25.91 24,26.42 23.75,26.42 23.62,26.54 23.62,27.88 U1.12
  Top 0.305: JP13.2 30.43,21.59 29.59,20.75 29.59,19.58 29.36,19.36
  Top 0.406: JP13.2 JP7.2
D9
  Top 0.254: U1.13 24.26,28.38 24.26,27.94 24.13,27.81 24.13,27.05 24.77,26.42 26.54,26.42 27.05,25.91 28.83,25.91 29.34,25.4 31.11,25.4 32.38,24.13 JP7.1
  Top 0.406: JP13.1 JP7.1
D10  (via drill 0.3)
  Top 0.254: U1.14 24.77,29 24.77,27.81 24.64,27.69 24.64,27.3 25.02,26.92 26.8,26.92 27.3,26.42 29.08,26.42 29.59,25.91 v32.03,25.91
  Top 0.406: JP12.12 JP6.12
  Bottom 0.254: JP6.12 33.78,38.61 33.78,27.69 v32.03,25.91
DTR
  Top 0.254: JP1.1 3.81,36.83 3.81,35.94 4.74,35.01 C2.2
GND  (via drill 0.3, 0.51, 1.8)
  Top 0.254: U1.3 17.35,30.48 | Q1.2 14.86,27.69 | C1.1 29.84,27.36 v29.95,27.36 | v10.16,34.27 10.16,33.02 10.14,33.02 U2.2
  Top 0.305: U$4.23 18.78,15.77 v18.8,15.75 | U$4.25 17.78,15.75 18.29,15.75 | 18.29,15.75 v18.8,15.75 | U$4.24 18.28,15.76 18.29,15.75 | U$4.33 16.24,15.73 v16.26,15.75 15.28,16.73 U$4.31 | U$4.2 15.78,12.45 | 15.78,12.45 15.78,12.73 v16.26,13.21 | U$4.1 15.28,11.95 15.78,12.45 | U$4.18 18.79,15.73 | 18.79,15.73 18.75,15.77 | 18.79,15.73 v18.79,15.74 v18.8,15.75 | U$4.14 21.3,13.73 v21.61,13.49 | C15.2 19.51,19.28 19.02,18.8 19.02,19.02 19.05,19.05
  Top 0.406: JP12.2 JP6.2 | JP13.9 JP7.9
  Top 1.016: D2.A 9.64,10.43 7.62,8.89 6.36,8.89 U$2.P-
  other vias: 21.59,34.29 19.81,32.51 31.62,31.75 5.08,28.19 13.84,33.27 19.81,29.21 8.89,37.62 17.35,30.58 1.27,41.91 17.53,14.48 18.8,13.21 11.68,15.75 25.07,15.34 16.89,7.42 14.91,27.18 4.85,31.72 10.49,18.57 11.02,10.36 20.57,7.01 33.3,8.51 33.3,6.93 3.02,40.49 26.95,29.29 17.2,26.82 19.08,18.82 13.97,18.8 5.31,17.37 23.55,12.67
  pour Top: 0,40.64 0,2.54 arc99 2.54,0 33.02,0 arc97 35.56,2.54 35.56,40.64 arc90 33.02,43.18 2.54,43.18 arc90
  pour Bottom: 0,40.64 0,2.54 arc99 2.54,0 33.02,0 arc97 35.56,2.54 35.56,40.64 arc90 33.02,43.18 2.54,43.18 arc90
MISO  (via drill 0.3)
  Top 0.254: U1.16 24.91,31.11 21.84,31.11 v21.59,30.86
  Top 0.406: JP12.10 JP6.10
  Bottom 0.254: v21.59,30.86 24.51,33.78 28.4,33.78 29.84,35.23 29.84,37.69 28.17,39.37 JP6.10
MOSI  (via drill 0.3)
  Top 0.254: U1.15 24.29,30.61 23.11,30.61 v22.73,30.23
  Top 0.406: JP12.11 JP6.11
  Bottom 0.254: v22.73,30.23 25.81,33.3 28.73,33.3 30.48,35.05 JP6.11
N$1
  Top 0.254: U1.8 18.44,25.91 16.38,25.91 16.06,26.23 Q1.1
N$2
  Top 0.254: Q1.3 13.66,26.09 14.35,25.4 19.18,25.4 20.32,26.54 20.32,27.3 19.81,27.81 19.21,27.81 U1.7
N$3  (via drill 0.3)
  Top 0.305: U$4.3 16.28,10.71 16.23,10.67 14.88,10.67 v14.5,10.69
  Bottom 0.305: v14.5,10.69 12.85,10.7 R4.1
N$4  (via drill 0.3)
  Top 0.305: U$4.6 17.78,6.62 17.65,6.5 15.93,6.5 15.65,6.78 | 15.65,6.78 C4.1 | v15.65,7.37 15.6,7.06 15.65,6.78
  Top 0.61: D1.C 7.62,13.46 v7.87,13.21
  Bottom 0.305: R4.2 11.27,7.36 v15.65,7.37
  Bottom 0.406: v7.87,13.21 7.87,10.59 8.18,10.29 8.18,8.76 9.6,7.32 10.22,7.26 R4.2
N$5
  Top 0.305: U$4.7 18.28,7.38 18.54,7.11 18.96,7.11 C5.1
N$6  (via drill 0.3)  (1 unrouted)
  Top 0.305: U$4.16 19.82,14.73 19.76,14.66 19.76,12.24 19.3,12.24 19.28,12.16 U$4.9 19.28,10.44 v19.56,10.16
  Top 1.016: C7.+ 27.1,7.9 26.8,8.64 25.91,8.64 v25.65,8.89
  Bottom 0.406: v25.65,8.89 25.15,8.89 23.88,10.16 v19.56,10.16
N$7
  Top 0.254: D3.A R6.2
N$8
  Top 0.305: U$4.10 19.78,11.21 20.57,10.41 C8.1 20.57,9.14 20.32,8.89
N$9
  Top 0.305: U$4.5 17.28,9.66 16.76,9.14 C6.1
N$10
  Top 0.305: U$4.4 16.78,10.25 16.71,10.13 15.7,10.13 15.65,10.11 C4.2
N$11
  Top 0.305: U$4.8 18.78,8.91 18.92,8.76 18.96,8.72 | 18.96,8.72 19.05,8.64 | C5.2 18.96,8.72
N$12
  Top 0.305: D2.C 10.74,6.63
  Top 1.016: 10.74,6.63 7.59,3.53 U$2.P+ 6.35,3.81 3.16,7 D1.A
N$13  (via drill 0.3)
  Top 0.305: R13.2 14.17,6.5 14.81,5.87 23.09,5.87 SW2.2 23.47,9.63 v25.27,11.43 | v25.25,19.36 25.31,19.36 R9.1
  Bottom 0.305: v25.27,11.43 25.27,12.32 25.93,12.98 25.93,18.77 v25.25,19.36
N$14
  Top 0.305: U$4.38 10.14,13.23 9.4,13.97 TP1.TP
N$15  (via drill 0.3)
  Top 0.305: R10.2 27.41,19.38 v27.66,19.43 | v31.19,19.43 31.34,19.43 LED2.A
  Bottom 0.305: v27.66,19.43 v31.19,19.43
N$17
  Top 0.305: U$4.35 11.86,14.73 Y1.3
N$18
  Top 0.305: U$4.34 13.73,15.23 13.21,15.75 13.21,16.51 12.95,16.76 11.87,16.76 Y1.1
N$22
  Top 0.305: U$4.17 21.12,15.23 22.28,14.07 25.93,14.05 26.77,13.21 29.05,13.13 L1.2
N$24
  Top 0.305: U$4.20 20.75,16.74 21.11,17.09 22.23,17.09 22.71,16.61 24.66,16.61 | 24.66,16.61 28.07,16.61 29.97,17.78 29.97,17.33 L1.1 | R5.1 25.23,16.62 24.66,16.61
N$38
  Top 0.254: R11.1 8.21,32.3 9.02,31.5 11.68,31.5 12.19,30.99 12.7,30.99 LED1.A
PROG_SW  (via drill 0.3)  (1 unrouted)
  Top 0.305: R9.2 22.19,19.3 C15.1
  Top 0.406: 22.19,19.3 22.19,19.7 21.67,20.22 19.33,20.22 v19.07,20.47
  Bottom 0.254: 16.51,20.9 SJ1.1 SJ2.1
  Bottom 0.406: v19.07,20.47 19.02,20.47 18.82,20.27 18.82,20.24 18.8,20.22 17.2,20.22 16.51,20.9
RESET  (via drill 0.3)
  Top 0.203: 12.57,37.34 12.57,35.81 13.21,35.18
  Top 0.254: S2.3 29.72,34.47 v29.72,31.75 29.72,29.82 29.9,29.64 S2.4 31.55,29.64 32.56,28.63 32.99,28.63 33.34,28.36 R2.1 | 5.08,37.24 C2.1 | 5.08,37.24 5.08,37.47 | 10.16,38.1 JP6.3 | 13.21,35.18 16.32,35.18 U1.29 17.72,33.78 18.92,33.78 v19.3,34.16 | 10.16,38.1 11.81,38.1 12.57,37.34 | 10.16,38.1 9.6,38.1 9.07,38.63 8.71,38.63 8.1,38.02 5.87,38.02 5.08,37.24
  Top 0.406: JP12.3 JP6.3 | JP13.10 JP7.10
  Bottom 0.254: v29.72,31.75 26.67,31.75 23.75,28.83 21.46,28.83 20.19,30.1 20.19,31.62 21.14,32.58 21.14,33.21 20.45,33.91 19.56,33.91 v19.3,34.16 19.23,34.24 12.55,34.24 12.12,33.81 12.12,30.89 12.34,30.66 12.34,27.33 11.96,26.95 10.54,26.95 10.13,26.54 JP7.10
RXD  (via drill 0.3)
  Top 0.305: U$4.27 16.78,19.8 16.36,20.22 v8.94,20.22
  Top 0.406: R8.2 v3.3,17.55
  Bottom 0.305: v8.94,20.22 6.3,20.22 3.63,17.58 v3.3,17.55
  Bottom 0.406: v3.3,17.55 2.54,16.56 2.54,6.35 3.81,5.08 7.62,5.08 10.16,2.54 13.97,2.54 JP9.3
RXI  (via drill 0.3)
  Top 0.254: U1.30 17.1,33.27 19.3,33.27 19.81,33.4 20.32,33.91 v20.32,35.05
  Top 0.406: JP7.11 JP13.11 7.62,19.91 R7.1 5.28,19.34 5.28,19.38 R12.2
  Bottom 0.254: 7.62,27.56 JP7.11 | 7.62,27.56 7.62,31.75 6.35,33.02 JP1.3 | v20.32,35.05 15.14,35.05 14.81,34.72 12.14,34.72 11.61,34.19 11.61,30.66 11.84,30.43 11.84,27.86 11.56,27.56 7.62,27.56
SAVEB
  Top 0.305: U$4.36 13.9,14.23 13.41,13.77 10.62,13.77 10.41,13.97 10.41,15.75 9.4,15.75 TP9.TP 9.4,15.77 9.22,15.6 5.16,15.62 4.7,16.08 2.62,16.08 1.91,16.79 1.88,20.93 JP5.1
SCK
  Top 0.254: JP6.9 25.91,39.37 27.18,38.1 27.56,38.1 28.56,37.1 R6.1 28.56,36.03 U1.17
  Top 0.406: JP12.9 JP6.9
TXD  (via drill 0.3)
  Top 0.305: U$4.28 16.28,19.28 15.9,19.66 9.7,19.66 8.76,18.69 8.2,18.09 7.9,17.78 7.63,17.7 R7.2
  Top 0.406: JP9.7 19.05,2.54 11.73,2.54 v10.77,3.5 | v7.14,17.5 R7.2
  Bottom 0.406: v10.77,3.5 10.21,3.5 7.82,5.89 4.39,5.89 3.43,6.86 3.43,13.18 6.68,16.43 6.99,16.76 v7.14,17.5
TXO
  Top 0.254: JP7.12 3.81,25.4 3.81,34.29 | 3.81,34.29 6.35,34.29 6.99,34.92 9.6,34.92 9.88,35.2 10.44,35.2 10.72,34.92 12.7,34.92 12.95,34.67 14.57,34.67 U1.31 | 3.81,34.29 JP1.2
  Top 0.406: R8.1 4.34,21.39 4.55,21.59 JP13.12 JP7.12
UC1  (via drill 0.3)
  Top 0.305: U$4.26 17.28,18.29 UC1.TP
  Bottom 0.305: UC1.TP 18.03,19.05 UC1_.TP
  other vias: 17.78,18.8
UC2  (via drill 0.3)
  Top 0.305: U$4.29 15.78,18.26 UC2.TP
  Bottom 0.305: UC2.TP 15.49,19.05 UC2_.TP
  other vias: 15.24,18.8
VCC  (via drill 0.3, 0.51)
  Top 0.254: 23.2,31.8 U1.18 | 23.2,31.8 23.15,31.75 | 23.24,31.75 23.2,31.8 | 23.24,31.75 21.08,31.75 20.32,30.99 20.32,30.1 | 17,28.97 17.02,28.96 | 17,28.97 U1.4 18.1,30.1 20.32,30.1 | 17,28.97 16.48,28.45 16,28.45 14.2,30.25 | 14.2,30.25 11.3,30.25 11.05,30 v11.05,29.84 | 6.76,29.46 v5.08,29.46 | 6.76,29.46 9.81,29.46 10.2,29.84 v11.05,29.84 | 6.76,29.46 R11.2 | 20.32,30.1 20.7,30.1 21.08,29.72 21.08,28.83 20.57,28.32 18.59,28.32 U1.6 | R2.2 31.62,27.59 31.62,28.45 29.44,28.45 28.3,29.59 28.3,30.38 27.89,30.79 27.03,30.79 26.98,30.84 | U2.5 v11.06,29.84 v11.05,29.84 | C3.2 27.03,31.04 26.31,31.75 23.24,31.75 | C10.1 14.83,29.34 14.91,29.41 14.2,30.12 14.2,30.25 | C13.A 10.11,28.02 10.97,28.88 10.97,29.77 v11.05,29.84
  Top 0.305: TP11.TP 12.53,18.8 C11.1 12.45,18.54 13.46,17.53 v13.56,17.53 15.23,17.53 U$4.30 | U$4.40 13.43,12.23 v13.21,12.37 | v13.21,12.37 C9.1 12.19,12.45 | U$4.19 21.56,16.23 v21.59,16.26 22.16,16.26 C12.1 22.93,15.71 v22.96,15.67 | U$4.11 21.75,12.23 v21.89,12.37 | TP13.TP 21.46,18.06 v21.59,18.03 22.25,18.03 22.68,17.6 R5.2 | 20.62,28.35 v20.65,28.32 20.57,28.32 | 26.98,30.84 26.98,31.02 C3.2 | R13.1 13.96,9.18 13.21,9.93 v13.21,12.37
  Top 0.406: JP12.4 JP6.4
  Bottom 0.254: JP1.4 4.06,30.48 v5.08,29.46 | JP6.4 12.01,39.37 10.49,37.85 10.49,37.12 R3.2 R1.2 10.47,35.63 11.05,35.05 v11.05,29.84 | 21.59,20.85 21.59,25.04 21.11,25.53
  Bottom 0.305: v21.59,16.26 v21.59,18.03 | v13.21,12.37 13.21,17.17 v13.56,17.53 13.56,17.5 20.07,17.5 20.6,18.03 v21.59,18.03 | v22.96,15.67 22.96,13.44 v21.89,12.37 | v21.59,18.03 21.59,20.85 | 21.11,25.53 21.11,27.86 v20.65,28.32
(copper drawn outside any net)
  shapes: Bottom area x2

### Text on the board
Bottom: 10-12-11
tPlace: Released under the Creative Commons Attribution Share-Alike 3.0 License | http://creativecommons.org/licenses/by-sa/3.0 | GRN | RAW | GND | RST | VCC | A3 | A2 | A1 | A0 | 13 | 12 | 11 | 10 | TXO | RXI | Reset | VCC | GND | TXO | RXI | RST | GND | 2 | 3 | 4 | 5 | 6 | 7 | 8 | 9 | BLK
bPlace: A5 | A4 | A7 | A6 | 5V | 3.3V | 20MHz | 16MHz | 10MHz | 8MHz